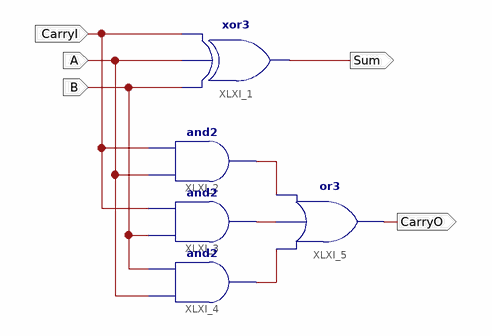
[diagram p0: schematic sheet 1]
// Xilinx ISE schematic FullAdder.sch (spartan3e) as structural Verilog: 5 symbols, 5 ports
module FullAdder (
  input  CarryI,
  input  A,
  input  B,
  output Sum,
  output CarryO
);

  wire XLXN_5, XLXN_6, XLXN_7;

  xor XLXI_1 (Sum, B, A, CarryI);
  and XLXI_2 (XLXN_5, A, CarryI);
  and XLXI_3 (XLXN_6, B, CarryI);
  and XLXI_4 (XLXN_7, A, B);
  or XLXI_5 (CarryO, XLXN_7, XLXN_6, XLXN_5);
endmodule
